# Altium project Smart_Lock.PrjPcb
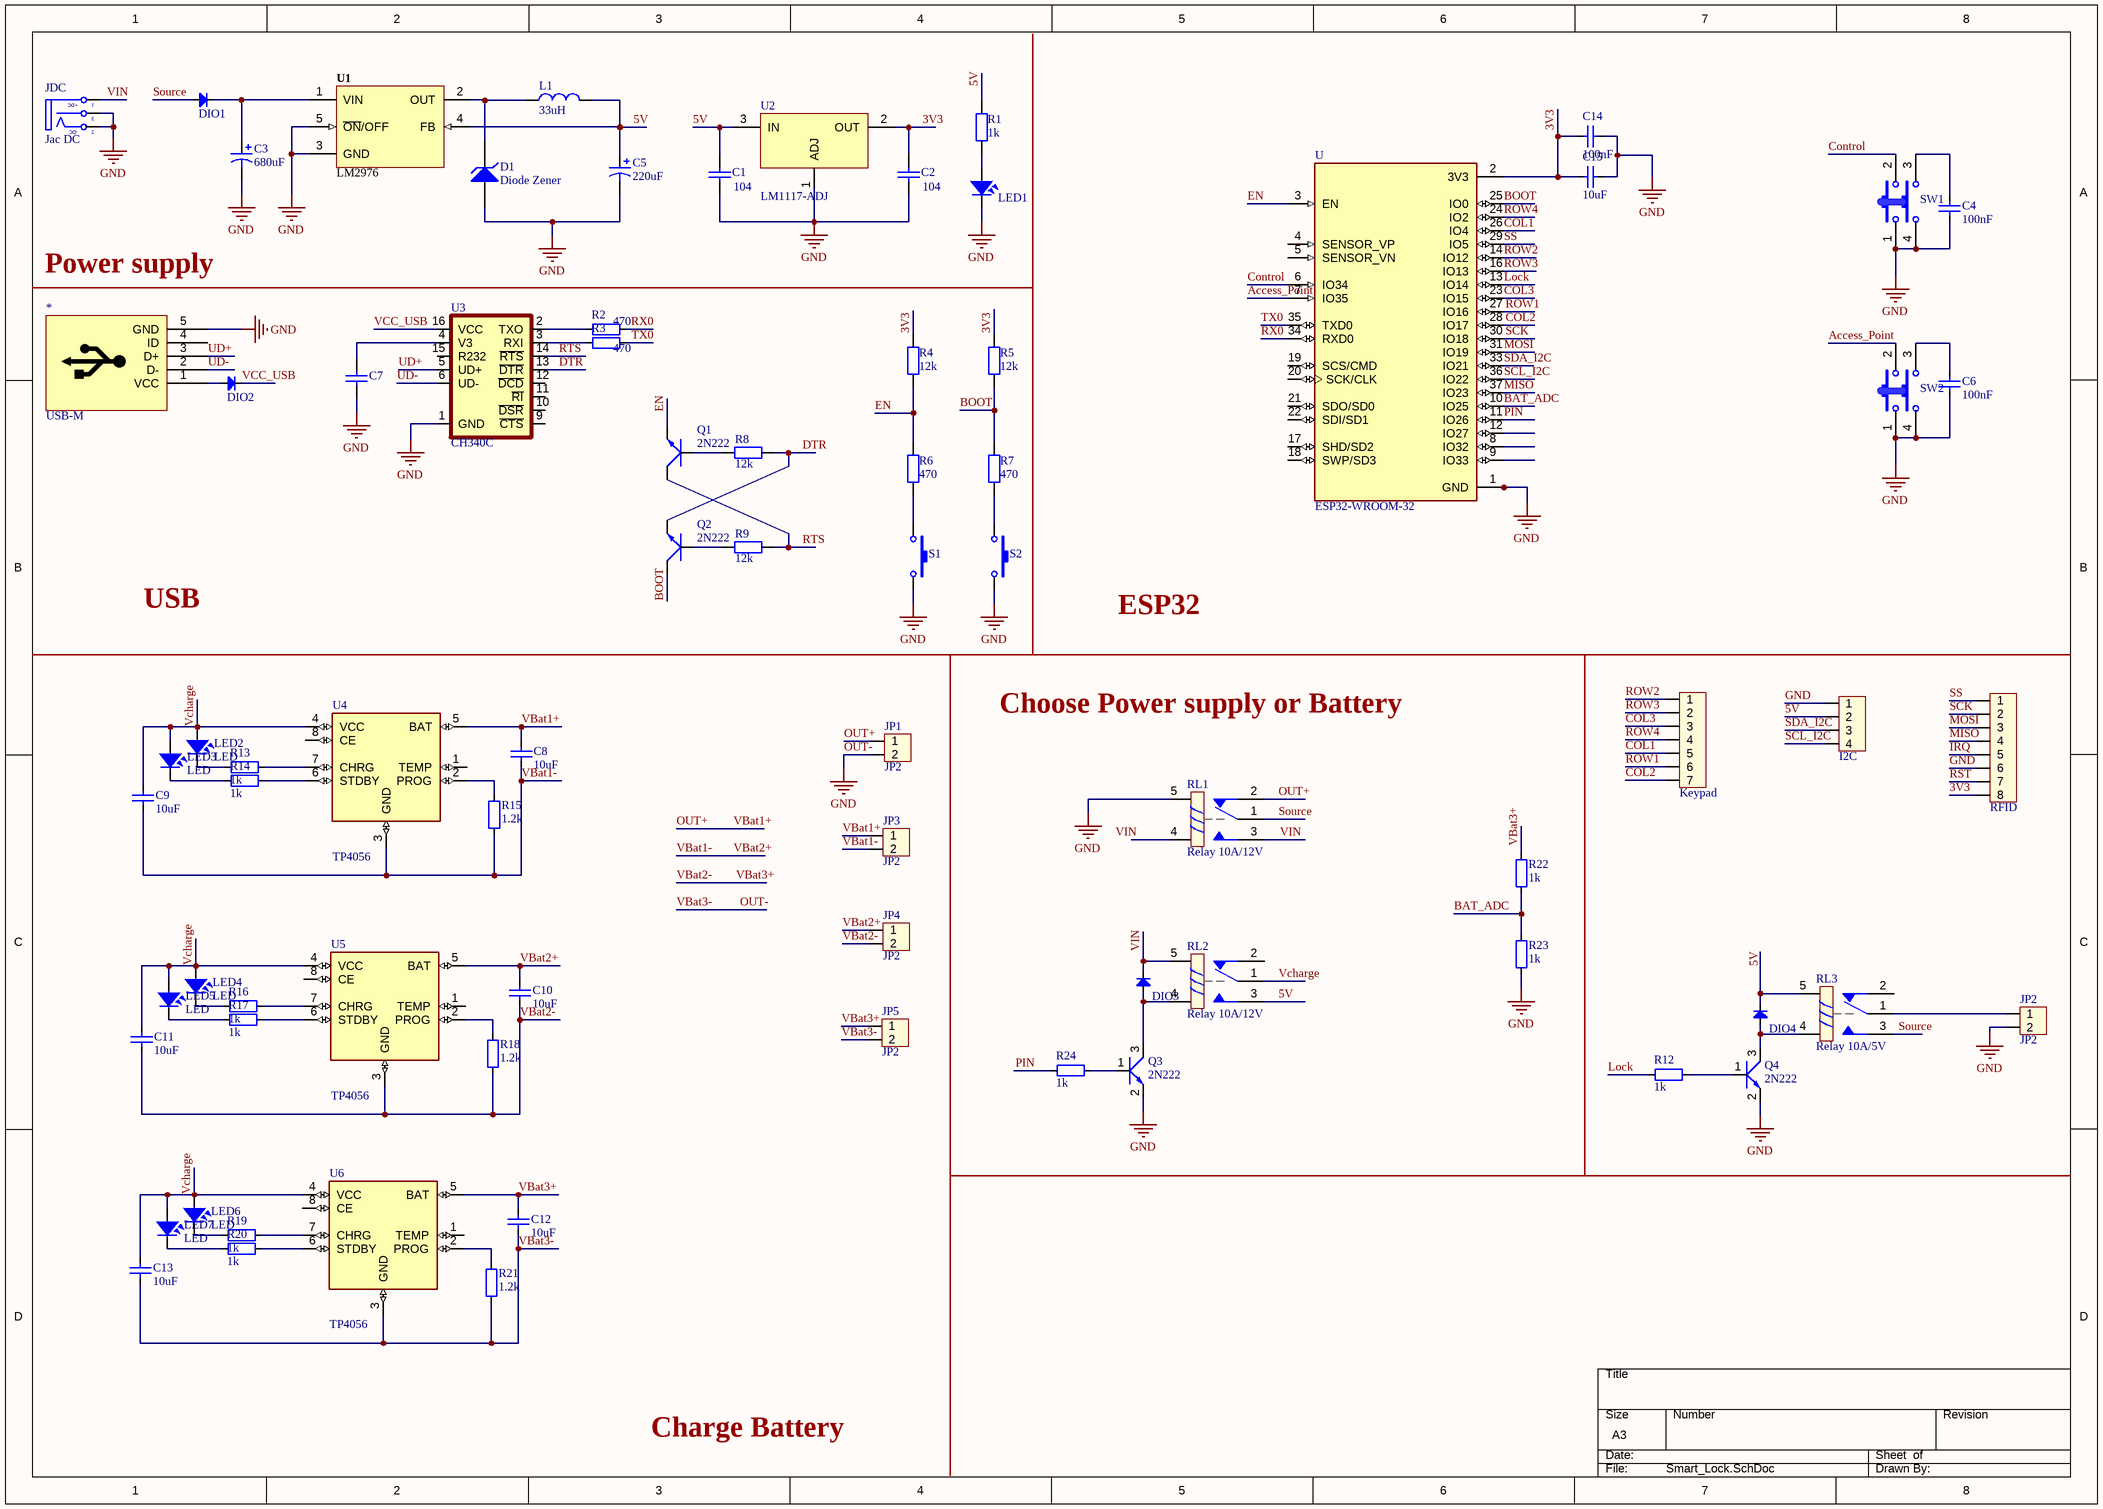
[diagram p0: Smart_Lock.SchDoc]
1 sheet, 78 parts. Net scope: global (net labels, ports and power ports of the same name join across sheets).
Board file: Smart_Lock.PcbDoc

## Sheet Smart_Lock.SchDoc: Smart Lock _ Project II
size A3; SheetNumber: 1; SheetTotal: 1

### Parts
(Parts that share a designator on the sheet are numbered #1, #2 ... from top to bottom, then left to right.)
#1  I2C  [CON4]
#2  Keypad  [Header7]
#3  RFID  [CON8]
*  USB-M  [USB-B-Mini]
C1  104  [CAP_0805]
C2  104  [CAP_0805]
C3  680uF  [C5mm]
C4  100nF  [CAP_0805]
C5  220uF  [C5mm]
C6  100nF  [CAP_0805]
C7  Capacitor Ceramic  [CAP_0805]  (value not drawn)
C8  10uF  [CAP_0805]
C9  10uF  [CAP_0805]
C10  10uF  [CAP_0805]
C11  10uF  [CAP_0805]
C12  10uF  [CAP_0805]
C13  10uF  [CAP_0805]
C14  100nF  [CAP_0805]
C15  10uF  [CAP_0805]
D1  Diode Zener  [SMA]
DIO1  Diode SMD  [DIO-SMD-106]  (value not drawn)
DIO2  Diode SMD  [DIO-SMD-106]  (value not drawn)
DIO3  Diode SMD  [DIO-SMD-106]  (value not drawn)
DIO4  Diode SMD  [DIO-SMD-106]  (value not drawn)
JDC  Jac DC  [DC-IN]
JP1  JP2  [CON2]
JP2  JP2  [CON2]
JP3  JP2  [CON2]
JP4  JP2  [CON2]
JP5  JP2  [CON2]
L1  33uH  [L-SMD-M-7.3x4.5]
LED1  LED  [LED-0805-Red]  (value not drawn)
LED2  LED  [LED-0805-Red]
LED3  LED  [LED-0805-Blue]
LED4  LED  [LED-0805-Red]
LED5  LED  [LED-0805-Blue]
LED6  LED  [LED-0805-Red]
LED7  LED  [LED-0805-Blue]
Q1  2N222  [SOT23-231]
Q2  2N222  [SOT23-231]
Q3  2N222  [SOT23D]
Q4  2N222  [SOT23D]
R1  value 1k  [RES-SMD-0805]  (hidden comment: R0.4W)
R2  470  [RES-SMD-0805]
R3  470  [RES-SMD-0805]
R4  value 12k  [RES-SMD-0805]  (hidden comment: R0.4W)
R5  value 12k  [RES-SMD-0805]  (hidden comment: R0.4W)
R6  value 470  [RES-SMD-0805]  (hidden comment: R0.4W)
R7  value 470  [RES-SMD-0805]  (hidden comment: R0.4W)
R8  value 12k  [RES-SMD-0805]  (hidden comment: R0.4W)
R9  value 12k  [RES-SMD-0805]  (hidden comment: R0.4W)
R12  1k  [RES-SMD-0805]
R13  1k  [RES-SMD-0805]
R14  1k  [RES-SMD-0805]
R15  1.2k  [RES-SMD-0805]
R16  1k  [RES-SMD-0805]
R17  1k  [RES-SMD-0805]
R18  1.2k  [RES-SMD-0805]
R19  1k  [RES-SMD-0805]
R20  1k  [RES-SMD-0805]
R21  1.2k  [RES-SMD-0805]
R22  1k  [RES-SMD-0805]
R23  1k  [RES-SMD-0805]
R24  1k  [RES-SMD-0805]
RL1  Relay 10A/12V  [RELAY 5]
RL2  Relay 10A/12V  [RELAY 5]
RL3  Relay 10A/5V  [RELAY 5]
S1  SW-SMD  [SW 3x2x4]  (value not drawn)
S2  SW-SMD  [SW 3x2x4]  (value not drawn)
SW1  SW-4P-S  [SW-4P-S]  (value not drawn)
SW2  SW-4P-S  [SW-4P-S]  (value not drawn)
U  ESP32-WROOM-32  [MODULE_ESP32-WROOM-32]
U1  LM2976  [TO263]
U2  LM1117-ADJ  [LM1117-SOP]
U3  CH340C  [SO016]
U4  TP4056  [TP4056]
U5  TP4056  [TP4056]
U6  TP4056  [TP4056]

### Nets
GND: #1.1 #3.6 *.5(GND) C1.1 C2.1 C3.2 C4.1 C5.2 C6.1 C7.1 C12.1 C13.1 C14.2 C15.2 D1.1(A) JDC.2(TN) JDC.3(S) JP1.2 JP2.2 JP5.2 LED1.2 Q3.2(E) Q4.2(E) R21.1 R23.1 RL1.5 S1.2 S2.2 SW1.1 SW1.4 SW2.1 SW2.4 U.1(GND) U.15(GND) U.38(GND) U.39_1(GND) U.39_2(GND) U.39_3(GND) U.39_4(GND) U.39_5(GND) U.39_6(GND) U.39_7(GND) U.39_8(GND) U.39_9(GND) U.39_10(GND) U.39_11(GND) U.39_12(GND) U.39_13(GND) U.39_14(GND) U.39_15(GND) U.39_16(GND) U.39_17(GND) U.39_18(GND) U.39_19(GND) U.39_20(GND) U.39_21(GND) U1.3(GND) U1.5(~{ON}/OFF) U2.1(ADJ) U3.1(GND) U6.3(GND)  [also labelled OUT-, VBat3-]
3V3: #3.8 C2.2 C14.1 C15.1 R4.2 R5.2 U.2(3V3) U2.2(OUT)
5V: #1.2 C1.2 C5.1 L1.2 R1.1 RL2.3 U1.4(FB) U2.3(IN)
Access_Point: SW2.2 U.7(IO35)
BAT_ADC: R22.1 R23.2 U.10(IO25)
BOOT: Q2.3(C) R5.1 R7.2 U.25(IO0)
COL1: #2.5 U.26(IO4)
COL2: #2.7 U.28(IO17)
COL3: #2.3 U.23(IO15)
Control: SW1.2 U.6(IO34)
DTR: Q2.1(E) R8.1 U3.13(~{DTR})
EN: Q1.1(E) R4.1 R6.2 U.3(EN)
IRQ: #3.5
Lock: R12.1 U.13(IO14)
MISO: #3.4 U.37(IO23)
MOSI: #3.3 U.31(IO19)
OUT+: C8.2 JP1.1 JP3.1 RL1.2 U4.5(BAT)  [also labelled VBat1+]
PIN: R24.1 U.11(IO26)
ROW1: #2.6 U.27(IO16)
ROW2: #2.1 U.14(IO12)
ROW3: #2.2 U.16(IO13)
ROW4: #2.4 U.24(IO2)
RST: #3.7
RTS: Q1.3(C) R9.1 U3.14(~{RTS})
RX0: R2.2 U.34(RXD0)
SCK: #3.2 U.30(IO18)
SCL_I2C: #1.4 U.36(IO22)
SDA_I2C: #1.3 U.33(IO21)
Source: DIO1.1(A) RL1.1 RL3.3
SS: #3.1 U.29(IO5)
TX0: R3.2 U.35(TXD0)
UD+: *.3(D+) U3.5(UD+)
UD-: *.2(D-) U3.6(UD-)
VBat1-: C8.1 C9.1 C10.2 JP3.2 JP4.1 R15.1 U4.3(GND) U5.5(BAT)  [also labelled VBat2+]
VBat2-: C10.1 C11.1 C12.2 JP4.2 JP5.1 R18.1 R22.2 U5.3(GND) U6.5(BAT)  [also labelled VBat3+]
VCC_USB: DIO2.2(K) U3.16(VCC)
Vcharge: C9.2 C11.2 C13.2 LED2.1 LED3.1 LED4.1 LED5.1 LED6.1 LED7.1 RL2.1 U4.4(VCC) U5.4(VCC) U6.4(VCC)
VIN: DIO3.2(K) JDC.1(T) RL1.3 RL2.5
Net*_1: *.1(VCC) DIO2.1(A)
NetC3_1: C3.1 DIO1.2(K) U1.1(VIN)
NetC4_2: C4.2 SW1.3
NetC6_2: C6.2 SW2.3
NetC7_2: C7.2 U3.4(V3)
NetD1_2: D1.2(K) L1.1 U1.2(OUT)
NetDIO3_1: DIO3.1(A) Q3.3(C) RL2.4
NetDIO4_1: DIO4.1(A) Q4.3(C) RL3.4
NetDIO4_2: DIO4.2(K) RL3.5
NetJP2_1: JP2.1 RL3.1
NetLED1_1: LED1.1 R1.2
NetLED2_2: LED2.2 R13.1
NetLED3_2: LED3.2 R14.1
NetLED4_2: LED4.2 R16.1
NetLED5_2: LED5.2 R17.1
NetLED6_2: LED6.2 R19.1
NetLED7_2: LED7.2 R20.1
NetQ1_2: Q1.2(B) R8.2
NetQ2_2: Q2.2(B) R9.2
NetQ3_1: Q3.1(B) R24.2
NetQ4_1: Q4.1(B) R12.2
NetR2_1: R2.1 U3.2(TXO)
NetR3_1: R3.1 U3.3(RXI)
NetR6_1: R6.1 S1.1
NetR7_1: R7.1 S2.1
NetR13_2: R13.2 U4.7(CHRG)
NetR14_2: R14.2 U4.6(STDBY)
NetR15_2: R15.2 U4.2(PROG)
NetR16_2: R16.2 U5.7(CHRG)
NetR17_2: R17.2 U5.6(STDBY)
NetR18_2: R18.2 U5.2(PROG)
NetR19_2: R19.2 U6.7(CHRG)
NetR20_2: R20.2 U6.6(STDBY)
NetR21_2: R21.2 U6.2(PROG)

Not connected (* = marked no-connect by the designer): * 4(ID); RL1 4; RL2 2; RL3 2; U 4(SENSOR_VP) 5(SENSOR_VN) 8(IO32) 9(IO33) 12(IO27) 17(SHD/SD2) 18(SWP/SD3) 19(SCS/CMD) 20(SCK/CLK) 21(SDO/SD0) 22(SDI/SD1); U3 9(~{CTS}) 10(~{DSR}) 11(~{RI}) 12(~{DCD}) 15(R232); U4 1(TEMP) 8(CE); U5 1(TEMP) 8(CE); U6 1(TEMP) 8(CE)

### Notes on the sheet
- (near *) Power supply
- USB
- ESP32
- Choose Power supply or Battery
- Charge Battery
- Labels drawn without touching a wire or pin: 5V, VIN
- DWG. NO.
- REV.
- SHT.
- REVISION
- DESCRIPTION
- DATE
- APPROVED
- THIS DOCUMENT AND THE DATA DISCLOSED HEREIN OR HEREWITH IS THE PROPERTY OF ALTIUM LIMITED AND MAY BE FREELY DISTRIBUTED IN WHOLE. NO RIGHTS ARE RESERVED OR EXPRESS OR IMPLIED WARANTEE GIVEN.
- ENG:
- DSN:
- APPROVALS
- PROJECT
- DOCUMENT REVISION:
- DESIGN ITEM:
- CHK:
- BOM:
- REFERENCE DOCUMENTS
- PROJECT REVISION:
- TITLE
- FAB DWG:
- PCB DWG:
- ASSY DWG:
- SCALE:
- SIZE
- C
- CAGE CODE
- FILE NAME
- DWG NO.
- SHEET
- OF
- REV
- (in symbol DCIN) +DC; -DC

### Library data of the parts
#1 = Con4: Connector 4
#2 = Header7: Connector 7
#3 = Con8: Connector 8
C1 C2 C4 C6-C15 = CapSMD: Capacitor; Value: 33p; Published: 8-Jun-2000; LatestRevisionDate: 17-Jul-2002; LatestRevisionNote: Re-released for DXP Platform.; PackageReference: RAD-0.3; Publisher: Altium Limited
C3 C5 = Cap Pol 5mm: Polarized Capacitor (Axial); Published: 8-Jun-2000; LatestRevisionDate: 17-Jul-2002; LatestRevisionNote: Re-released for DXP Platform.; PackageReference: POLAR0.8; Publisher: Altium Limited
D1 = Diode Zener: Zener Diode; Published: 8-Jun-2000; LatestRevisionDate: 17-Jul-2002; LatestRevisionNote: Re-released for DXP Platform.; PackageReference: DIODE-0.7; Publisher: Altium Limited
DIO1-DIO4 = Diode SMD: Default Diode; Code - JEDEC: DO-214-AB; Value: 1N5007; Published: 8-Jun-2000; Revision: July-2002: Re-released for DXP Platform.; Publisher: Altium Limited
JDC = DCIN: Jac DC input; Value: Jac DC
JP1-JP5 = Con2: Connector 2; Value: Connector 2
L1 = L1: Inductor; Value: 150 mH
LED1 = LED SMD: Value: LED 3 - 5 ly 2 Colour
LED2-LED7 = LED: LED Single colour Green and Red; Value: LED 3 ly Single Colour
Q1-Q4 = 2N222: NPN 600mW, ECB; Value: C1815
R1 R4-R9 = Res 1/4 W: Resistor; Published: 8-Jun-2000; LatestRevisionDate: 17-Jul-2002; LatestRevisionNote: Re-released for DXP Platform.; PackageReference: AXIAL-0.4; Publisher: Altium Limited
R2 R3 R12-R24 = Resistor - SMD: Resistor; Manufacturer: Generic Components; Class: Passive; Published: 08/06/2000; Publisher: Altium Hobart Technology Centre
RL1-RL3 = Relay 5: Relay SPDT,10A - 12VDC 5 Pin; Value: Relay SPDT, 10A, 12V
S1 S2 = SW-SMD: Switch; Published: 24-Mar-1999; LatestRevisionDate: 17-Jul-2002; LatestRevisionNote: Re-released for DXP Platform.; PackageReference: SPST-2; Publisher: Altium Limited
SW1 SW2 = SW-4PIN-SMALL: Switch Small 4 Pin; Published: 24-Mar-1999; LatestRevisionDate: 17-Jul-2002; LatestRevisionNote: Re-released for DXP Platform.; PackageReference: SPST-2; Publisher: Altium Limited
U = ESP32-WROOM-32: Bluetooth, WiFi Transceiver Module 2.4GHz ~ 2.5GHz Surface Mount; MF: Espressif Systems; Package: Module Espressif Systems; Digi-Key_Part_Number: 1904-1010-1-ND; Digi-Key_Purchase_URL: https://www.digikey.com/product-detail/en/espressif-systems/ESP32-WROOM-32/1904-1010-1-ND/8544305?utm_source=snapeda&utm_medium=aggregator&utm_campaign=symbol; Value: *; MP: ESP32-WROOM-32; SnapEDA_Link: https://www.snapeda.com/parts/ESP32-WROOM-32/Espressif%20Systems/view-part/2753322/?ref=snap
U1 = LM2596: Max Input Voltage: 12 V; Max Output Current: 3 (6.0 peak) A; Max Output Voltage: mV; Category: IC-Power; Min Input Voltage: mV; Min Output Voltage: mV; Mounting Technology: Surface Mount; Status: Unreleased; Supply Voltage: mV; Temperature Range: -40 to +125 degC
U2 = LM1117-ADJ: 800mA Low-Dropout Linear Regulator; Creator: Nguyen Ba Bien; Website: http://group3i.net
U3 = CH340C: USB to serial chip CH340; MF: WCH; Package: Package; Check_prices: https://www.snapeda.com/parts/CH340C/WCH/view-part/5428851/?ref=eda; Value: *; Price: None; MP: CH340C; Availability: Unavailable; SnapEDA_Link: https://www.snapeda.com/parts/CH340C/WCH/view-part/5428851/?ref=snap
U4-U6 = TP4056: Complete single cell Li-Ion battery with a constant current / constant voltage linear charger